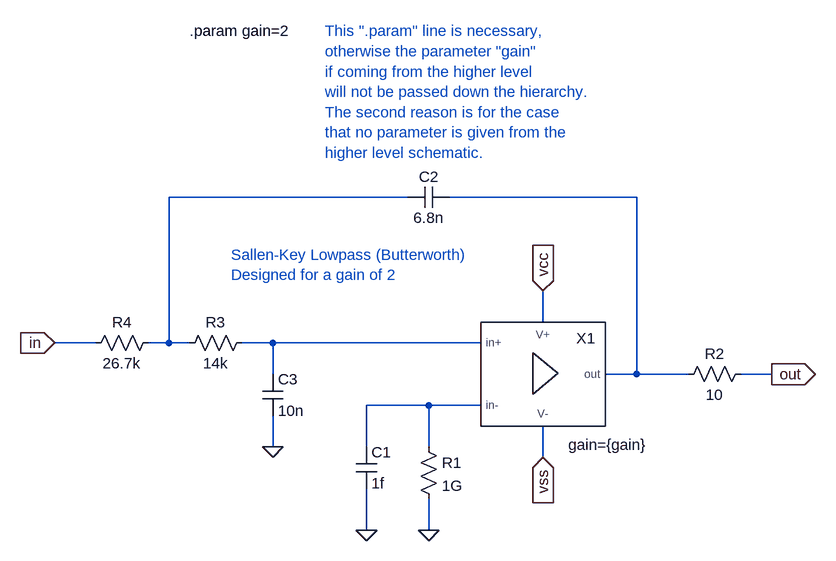
[diagram p0: schematic filter2_sallen_key.asc]
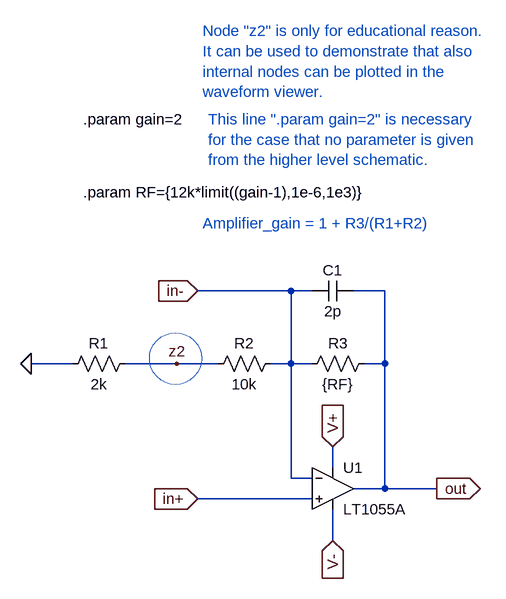
[diagram p1: sub-circuit opamp_gain2.asc]
filter2_sallen_key.asc, the LTspice schematic file:
Version 4
SHEET 1 880 680
WIRE -544 160 -608 160
WIRE -432 160 -464 160
WIRE -432 160 -432 -64
WIRE -400 160 -432 160
WIRE -272 160 -320 160
WIRE -272 208 -272 160
WIRE -272 320 -272 272
WIRE -128 320 -128 256
WIRE -128 448 -128 384
WIRE -64 -64 -432 -64
WIRE -32 256 -128 256
WIRE -32 320 -32 256
WIRE -32 448 -32 400
WIRE 48 160 -272 160
WIRE 48 256 -32 256
WIRE 144 128 144 80
WIRE 144 336 144 288
WIRE 288 -64 0 -64
WIRE 288 208 240 208
WIRE 288 208 288 -64
WIRE 368 208 288 208
WIRE 496 208 448 208
FLAG -32 448 0
FLAG -128 448 0
FLAG 144 80 vcc
IOPIN 144 80 In
FLAG 144 336 vss
IOPIN 144 336 In
FLAG 496 208 out
IOPIN 496 208 Out
FLAG -608 160 in
IOPIN -608 160 In
FLAG -272 320 0
SYMBOL opamp_gain2 144 224 R0
WINDOW 0 51 -71 Left 0
WINDOW 39 39 93 Left 0
SYMATTR InstName X1
SYMATTR SpiceLine gain={gain}
SYMBOL res -48 304 R0
SYMATTR InstName R1
SYMATTR Value 1G
SYMBOL cap -144 320 R0
SYMATTR InstName C1
SYMATTR Value 1f
SYMBOL res 352 224 R270
WINDOW 0 32 56 VTop 0
WINDOW 3 0 56 VBottom 0
SYMATTR InstName R2
SYMATTR Value 10
SYMBOL cap -64 -48 R270
WINDOW 0 32 32 VTop 0
WINDOW 3 0 32 VBottom 0
SYMATTR InstName C2
SYMATTR Value 6.8n
SYMBOL res -416 176 R270
WINDOW 0 32 56 VTop 0
WINDOW 3 0 56 VBottom 0
SYMATTR InstName R3
SYMATTR Value 14k
SYMBOL res -560 176 R270
WINDOW 0 32 56 VTop 0
WINDOW 3 0 56 VBottom 0
SYMATTR InstName R4
SYMATTR Value 26.7k
SYMBOL cap -288 208 R0
SYMATTR InstName C3
SYMATTR Value 10n
TEXT -400 -320 Left 0 !.param gain=2
TEXT -192 -320 Left 0 ;This ".param" line is necessary, \notherwise the parameter "gain"\nif coming from the higher level\nwill not be passed down the hierarchy.\nThe second reason is for the case\nthat no parameter is given from the \nhigher level schematic.
TEXT -336 24 Left 0 ;Sallen-Key Lowpass (Butterworth)\nDesigned for a gain of 2

opamp_gain2.asc, the sub-circuit schematic file:
Version 4
SHEET 1 880 680
WIRE -208 48 -272 48
WIRE -48 48 -128 48
WIRE 16 48 -48 48
WIRE 128 -64 -16 -64
WIRE 128 48 96 48
WIRE 128 48 128 -64
WIRE 128 224 128 48
WIRE 160 -64 128 -64
WIRE 160 48 128 48
WIRE 160 224 128 224
WIRE 160 256 -16 256
WIRE 192 208 192 176
WIRE 192 320 192 272
WIRE 272 -64 224 -64
WIRE 272 48 240 48
WIRE 272 48 272 -64
WIRE 272 240 224 240
WIRE 272 240 272 48
WIRE 352 240 272 240
FLAG -272 48 0
FLAG 352 240 out
IOPIN 352 240 Out
FLAG -16 256 in+
IOPIN -16 256 In
FLAG 192 176 V+
IOPIN 192 176 In
FLAG 192 320 V-
IOPIN 192 320 In
FLAG -16 -64 in-
IOPIN -16 -64 In
FLAG -48 48 z2
SYMBOL Opamps\\LT1055A 192 176 R0
SYMATTR InstName U1
SYMBOL res 144 64 R270
WINDOW 0 32 56 VTop 0
WINDOW 3 0 56 VBottom 0
SYMATTR InstName R3
SYMATTR Value {RF}
SYMBOL res 0 64 R270
WINDOW 0 32 56 VTop 0
WINDOW 3 0 56 VBottom 0
SYMATTR InstName R2
SYMATTR Value 10k
SYMBOL cap 160 -48 R270
WINDOW 0 32 32 VTop 0
WINDOW 3 0 32 VBottom 0
SYMATTR InstName C1
SYMATTR Value 2p
SYMBOL res -224 64 R270
WINDOW 0 32 56 VTop 0
WINDOW 3 0 56 VBottom 0
SYMATTR InstName R1
SYMATTR Value 2k
TEXT -192 -216 Left 0 !.param RF={12k*limit((gain-1),1e-6,1e3)}
TEXT -192 -328 Left 0 !.param gain=2
TEXT -8 -168 Left 0 ;Amplifier_gain = 1 + R3/(R1+R2)
TEXT 0 -328 Left 0 ;This line ".param gain=2" is necessary \nfor the case that no parameter is given \nfrom the higher level schematic.
TEXT -8 -464 Left 0 ;Node "z2" is only for educational reason.\nIt can be used to demonstrate that also\ninternal nodes can be plotted in the \nwaveform viewer.
CIRCLE Normal -10 80 -90 0 2

The netlist it stands for:
* filter2_sallen_key.asc
XX1 N002 N003 vcc vss N004 opamp_gain2 params: gain={gain}
R1 N003 0 1G
C1 N003 0 1f
R2 N004 out 10
C2 N001 N004 6.8n
R3 N001 N002 14k
R4 in N001 26.7k
C3 N002 0 10n

* block symbol definitions
.subckt opamp_gain2 in+ in- V+ V- out
XU1 in+ in- V+ V- out LT1055A  ; pins In+ In- V+ V- OUT
R3 in- out {RF}
R2 z2 in- 10k
C1 in- out 2p
R1 0 z2 2k
.param RF={12k*limit((gain-1),1e-6,1e3)}
.param gain=2
* Amplifier_gain = 1 + R3/(R1+R2)
* This line ".param gain=2" is necessary
* for the case that no parameter is given
* from the higher level schematic.
* Node "z2" is only for educational reason.
* It can be used to demonstrate that also
* internal nodes can be plotted in the
* waveform viewer.
.ends opamp_gain2

.param gain=2
* This ".param" line is necessary,
* otherwise the parameter "gain"
* if coming from the higher level
* will not be passed down the hierarchy.
* The second reason is for the case
* that no parameter is given from the
* higher level schematic.
* Sallen-Key Lowpass (Butterworth)
* Designed for a gain of 2
.backanno
.end